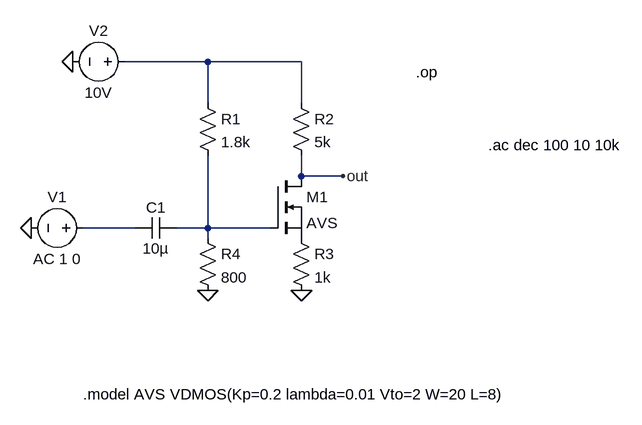
[diagram p0: schematic NMOS.asc]
NMOS.asc, the LTspice schematic file:
Version 4
SHEET 1 880 680
WIRE 208 -80 80 -80
WIRE 352 -80 208 -80
WIRE 208 -16 208 -80
WIRE 352 -16 352 -80
WIRE 352 96 352 64
WIRE 416 96 352 96
WIRE 96 176 16 176
WIRE 208 176 208 64
WIRE 208 176 160 176
WIRE 304 176 208 176
WIRE 208 192 208 176
FLAG -64 176 0
FLAG 0 -80 0
FLAG 416 96 out
FLAG 352 272 0
FLAG 208 272 0
SYMBOL nmos 304 96 R0
SYMATTR InstName M1
SYMATTR Value AVS
SYMBOL cap 160 160 R90
WINDOW 0 0 32 VBottom 2
WINDOW 3 32 32 VTop 2
SYMATTR InstName C1
SYMATTR Value 10µ
SYMBOL voltage 32 176 R90
WINDOW 0 -32 56 VBottom 2
WINDOW 3 32 56 VTop 2
SYMATTR InstName V1
SYMATTR Value AC 1 0
SYMBOL voltage 96 -80 R90
WINDOW 0 -32 56 VBottom 2
WINDOW 3 32 56 VTop 2
SYMATTR InstName V2
SYMATTR Value 10V
SYMBOL res 192 -32 R0
SYMATTR InstName R1
SYMATTR Value 1.8k
SYMBOL res 336 -32 R0
SYMATTR InstName R2
SYMATTR Value 5k
SYMBOL res 336 176 R0
SYMATTR InstName R3
SYMATTR Value 1k
SYMBOL res 192 176 R0
SYMATTR InstName R4
SYMATTR Value 800
TEXT 528 -64 Left 2 !.op
TEXT 16 432 Left 2 !.model AVS VDMOS(Kp=0.2 lambda=0.01 Vto=2 W=20 L=8)
TEXT 640 48 Left 2 !.ac dec 100 10 10k

The netlist it stands for:
* NMOS.asc
M1 out N003 P001 P001 AVS
C1 N003 N002 10µ
V1 N002 0 AC 1 0
V2 N001 0 10V
R1 N001 N003 1.8k
R2 N001 out 5k
R3 P001 0 1k
R4 N003 0 800
.model NMOS NMOS
.model PMOS PMOS
.lib standard.mos
.op
.model AVS VDMOS(Kp=0.2 lambda=0.01 Vto=2 W=20 L=8)
.ac dec 100 10 10k
.backanno
.end